# Altium schematic sheet IR sensor.SchDoc
size A; SheetNumber: 1; SheetTotal: 1
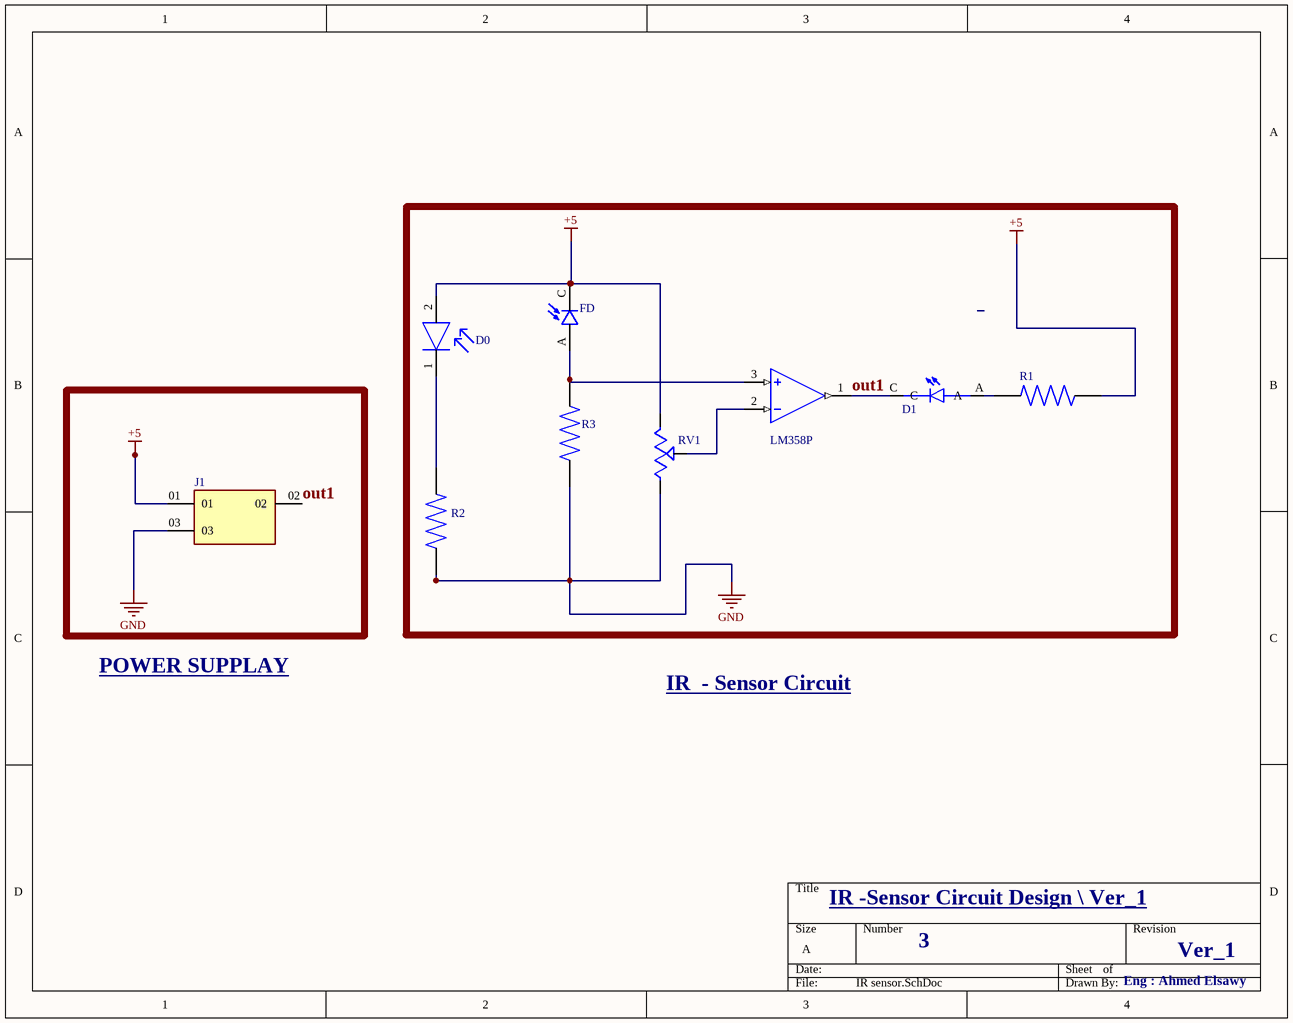
[diagram p0: IR sensor.SchDoc]

## Parts
D0  BPV10  [Vishay_6.544-5185.02-4_MFG]  (value not drawn)
D1  WP7113ID  [LED_WP7113ID]  (value not drawn)
FD  BPV10NF  [XDCR_BPV10NF]  (value not drawn)
J1  TSW-101-07-T-T  [SAMTEC_TSW-101-07-T-T]  (value not drawn)
LM358P  LM358P  [DIP794W45P254L959H508Q8]  (part A of 3)
R1  ERJP08F3300V  [RES_ERJP08F3300V]  (value not drawn)
R2  100  [RESC1608X55N]  (value not drawn)
R3  ERA3ARB103V  [RES_ERA3ARB103V]  (value not drawn)
RV1  EVN-D8AA03B14  [TRIM_EVN-D8AA03B14]  (value not drawn)

## Nets
+5: D0.2(A) FD.C J1.01 R1.2 RV1.3
GND: J1.03 R2.1 R3.1 RV1.1
out1: D1.C J1.02 LM358P.1(OUT1)
NetD0_1: D0.1(C) R2.2
NetD1_A: D1.A R1.1
NetFD_A: FD.A LM358P.3(+IN1) R3.2
NetLM358P_2: LM358P.2(-IN1) RV1.2

## Notes on the sheet
- POWER SUPPLAY
- IR  - Sensor Circuit
- IR -Sensor Circuit Design \ Ver_1
- 3
- Ver_1
- Eng : Ahmed Elsawy

## Library data of the parts
D1 = WP7113ID: Red 617nm LED Indication - Discrete 2V Radial; MF: Kingbright; Price: None; MP: WP7113ID; Package: Radial Kingbright; Check_prices: https://www.snapeda.com/parts/WP7113ID/Kingbright/view-part/?ref=eda; Purchase-URL: https://pricing.snapeda.com/search/part/WP7113ID/?ref=eda; Availability: In Stock; Value: *; SnapEDA_Link: https://www.snapeda.com/parts/WP7113ID/Kingbright/view-part/?ref=snap
FD = BPV10NF: Photodiodes T-1.75 790 to 1050nm +/-20 deg; MF: Vishay Semiconductors; SnapEDA_Link: https://www.snapeda.com/parts/BPV10NF/Vishay/view-part/?ref=snap; Package: None; MP: BPV10NF; Check_prices: https://www.snapeda.com/parts/BPV10NF/Vishay/view-part/?ref=eda; Purchase-URL: https://pricing.snapeda.com/search/part/BPV10NF/?ref=eda; Price: None; Value: *; Availability: In Stock
J1 = TSW-101-07-T-T: MF: Samtec; Package: None; Value: *; Availability: Unavailable; MP: TSW-101-07-T-T; Price: None
LM358P = LM358P: Dual, 30-V, 700-kHz operational amplifier; MF: Texas Instruments; SnapEDA_Link: https://www.snapeda.com/parts/LM358P/Texas+Instruments/view-part/?ref=snap; Package: PDIP-8 Texas; MP: LM358P; Check_prices: https://www.snapeda.com/parts/LM358P/Texas+Instruments/view-part/?ref=eda; Purchase-URL: https://pricing.snapeda.com/search/part/LM358P/?ref=eda; Price: None; Value: *; Availability: In Stock
R2 = CRGH0603J100R: CRGH0603 5% 100R 0.2W; Package: None; Price: None; Value: *; MP: CRGH0603J100R; Availability: Unavailable
RV1 = EVN-D8AA03B14: 10 kOhms 0.1W, 1/10W PC Pins Through Hole Trimmer Potentiometer Carbon 1.0 Turn Top Adjustment; MF: Panasonic Electronic; SnapEDA_Link: https://www.snapeda.com/parts/EVN-D8AA03B14/Panasonic+Electronic+Components/view-part/?ref=snap; Package: PQFP-44 Panasonic; MP: EVN-D8AA03B14; Check_prices: https://www.snapeda.com/parts/EVN-D8AA03B14/Panasonic+Electronic+Components/view-part/?ref=eda; Purchase-URL: https://pricing.snapeda.com/search/part/EVN-D8AA03B14/?ref=eda; Price: None; Value: *; Availability: In Stock
R1 = ERJP08F3300V: MP: ERJP08F3300V; Package: None; Price: None; Availability: Unavailable; Value: *
R3 = ERA3ARB103V: MP: ERA3ARB103V; Availability: Unavailable; Package: None; Value: *; Price: None